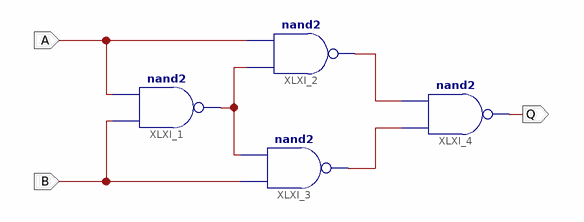
[diagram p0: schematic sheet 1]
// Xilinx ISE schematic lab4exp1.sch (spartan3e) as structural Verilog: 4 symbols, 3 ports
module lab4exp1 (
  input  A,
  input  B,
  output Q
);

  wire XLXN_18, XLXN_20, XLXN_21;

  nand XLXI_1 (XLXN_18, B, A);
  nand XLXI_2 (XLXN_20, XLXN_18, A);
  nand XLXI_3 (XLXN_21, B, XLXN_18);
  nand XLXI_4 (Q, XLXN_21, XLXN_20);
endmodule
